# Altium project Pedal_MB.PrjPcb (part 4 of 4)

## Sheet UI.SchDoc
size A2
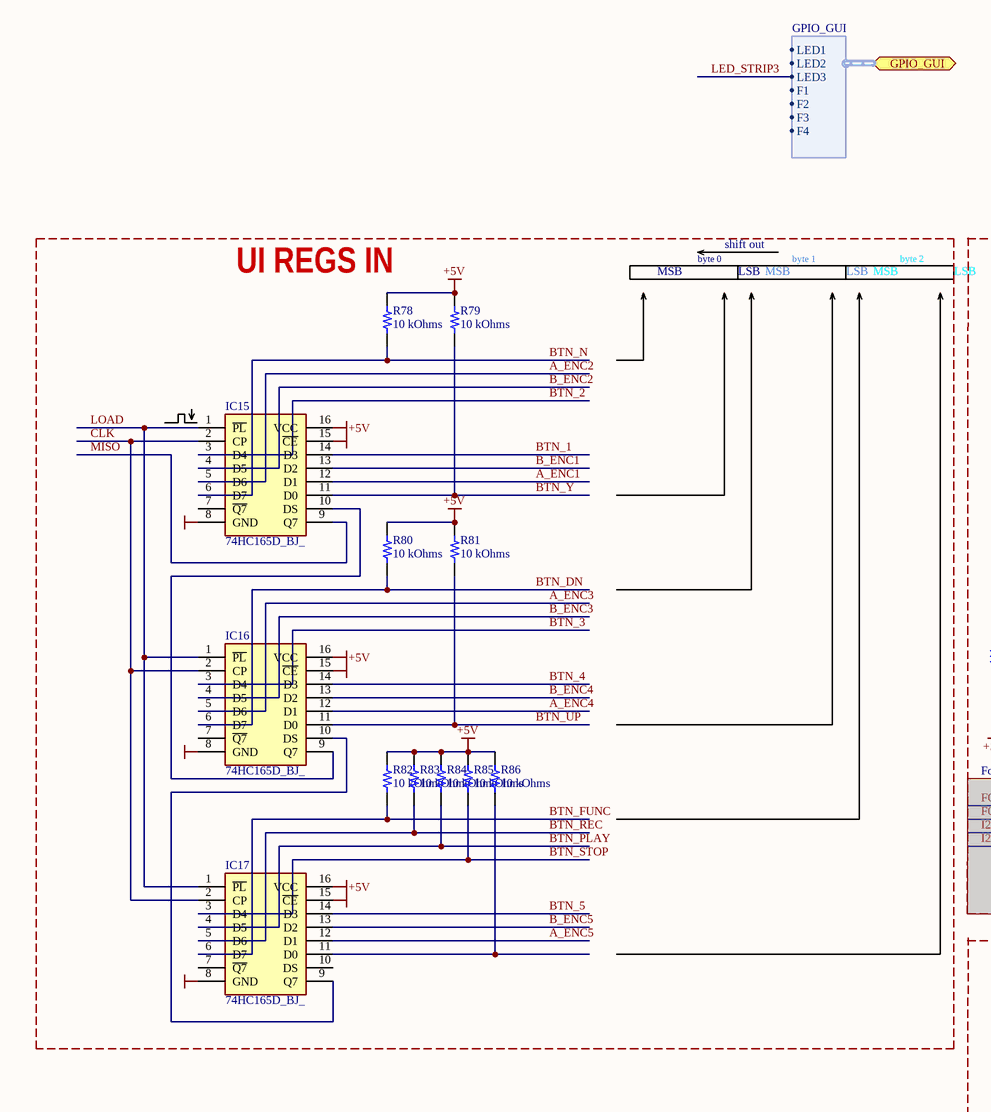
[diagram p21: UI.SchDoc, left]
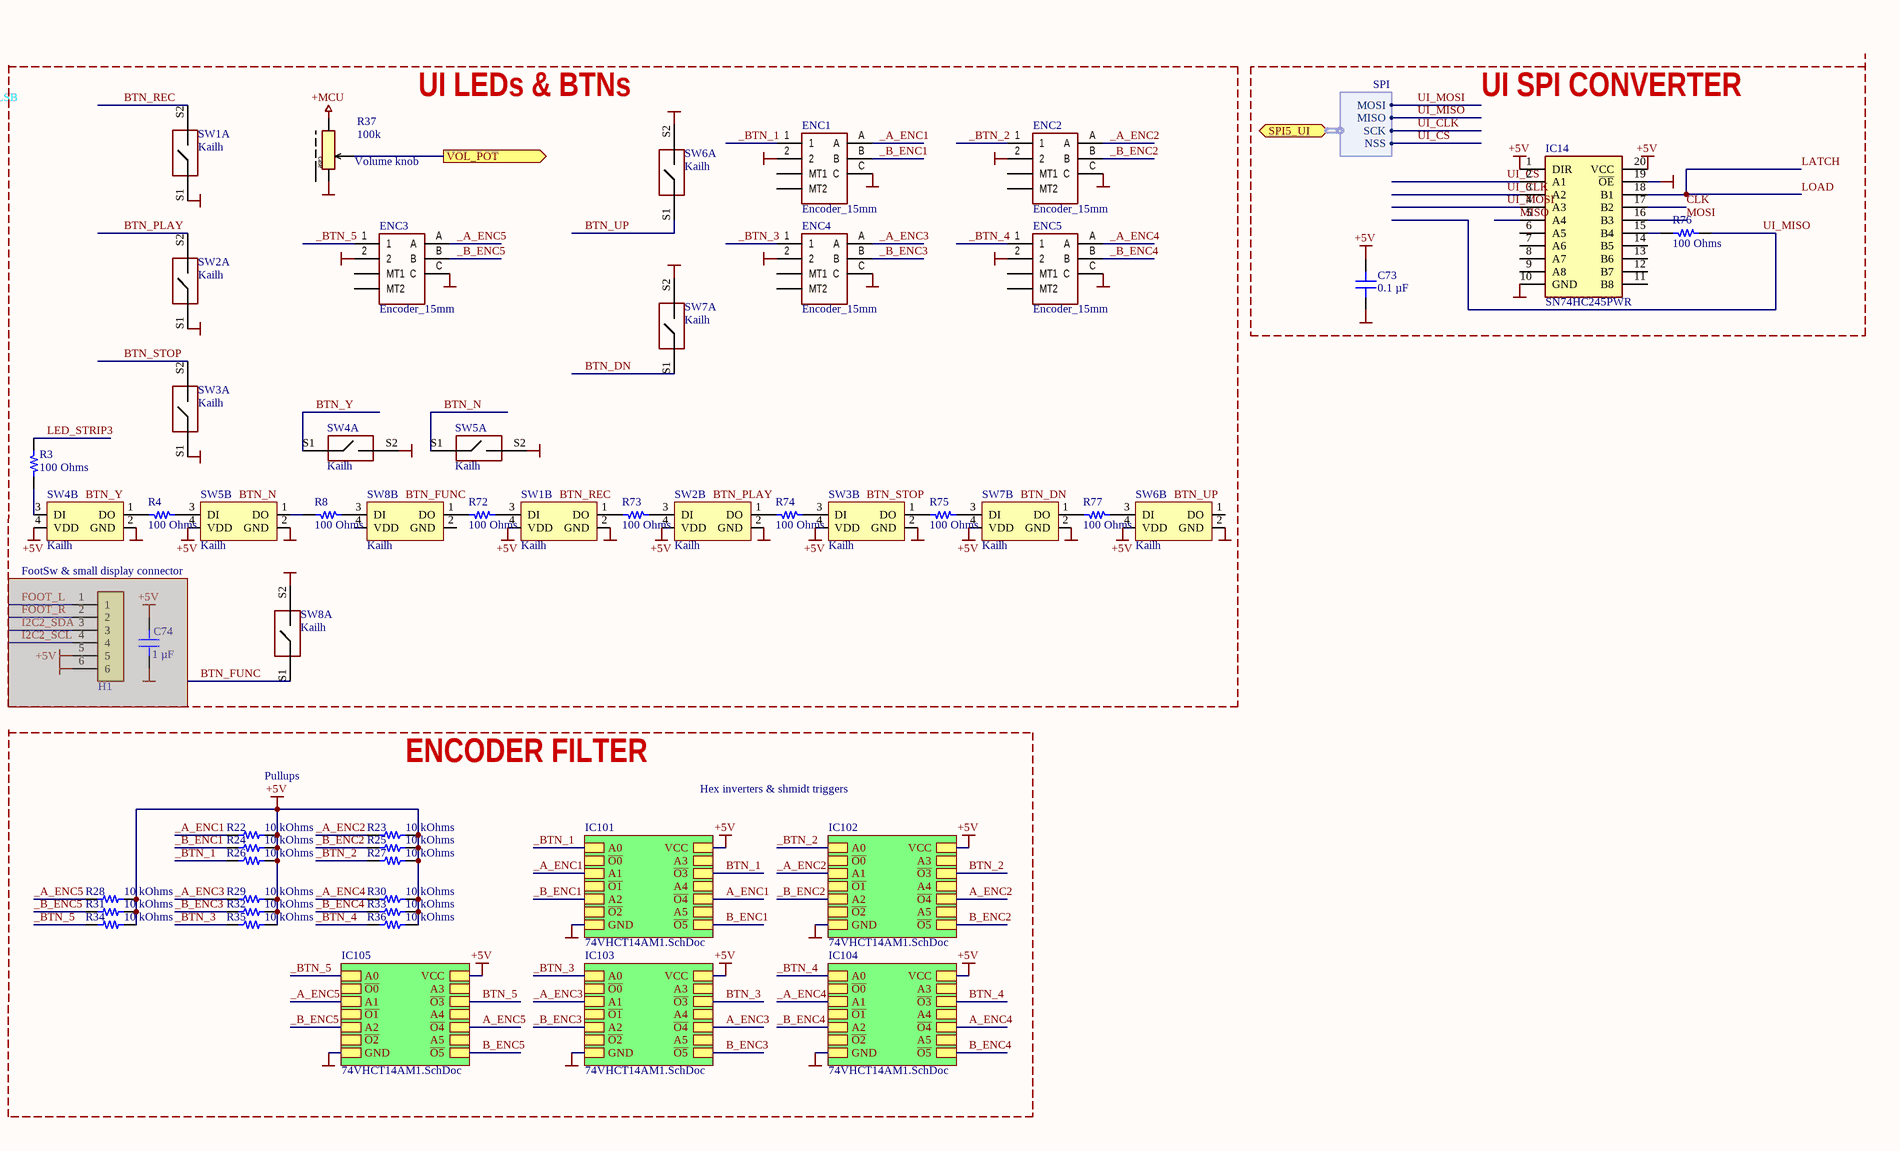
[diagram p22: UI.SchDoc, right]

### Parts
(Parts that share a designator on the sheet are numbered #1, #2 ... from top to bottom, then left to right.)
C73  0.1 µF  [CAP 0603_1608]
C74#2  1 µF  [CAP 0805_2012]  (masked out: inside a compile mask, not in the netlist)
ENC1  Encoder_15mm  [EC11_15mm]
ENC2  Encoder_15mm  [EC11_15mm]
ENC3  Encoder_15mm  [EC11_15mm]
ENC4  Encoder_15mm  [EC11_15mm]
ENC5  Encoder_15mm  [EC11_15mm]
H1#2  1.5-6A  [1.5-6A]  (value not drawn)  (masked out: inside a compile mask, not in the netlist)
IC14  SN74HC245PWR  [SOP65P640X120-20N]
IC15  74HC165D_BJ_  [SOIC127P600X175-16N]
IC16  74HC165D_BJ_  [SOIC127P600X175-16N]
IC17  74HC165D_BJ_  [SOIC127P600X175-16N]
R3#2  100 Ohms  [RES 0402_1005]
R4#2  100 Ohms  [RES 0402_1005]
R8#2  100 Ohms  [RES 0402_1005]
R22  10 kOhms  [RES 0603_1608]
R23  10 kOhms  [RES 0603_1608]
R24  10 kOhms  [RES 0603_1608]
R25  10 kOhms  [RES 0603_1608]
R26  10 kOhms  [RES 0603_1608]
R27  10 kOhms  [RES 0603_1608]
R28  10 kOhms  [RES 0603_1608]
R29  10 kOhms  [RES 0603_1608]
R30  10 kOhms  [RES 0603_1608]
R31  10 kOhms  [RES 0603_1608]
R32  10 kOhms  [RES 0603_1608]
R33  10 kOhms  [RES 0603_1608]
R34  10 kOhms  [RES 0603_1608]
R35  10 kOhms  [RES 0603_1608]
R36  10 kOhms  [RES 0603_1608]
R37  100k  [POT]
R72  100 Ohms  [RES 0402_1005]
R73  100 Ohms  [RES 0402_1005]
R74  100 Ohms  [RES 0402_1005]
R75  100 Ohms  [RES 0402_1005]
R76  100 Ohms  [RES 0402_1005]
R77  100 Ohms  [RES 0402_1005]
R78  10 kOhms  [RES 0603_1608]
R79  10 kOhms  [RES 0603_1608]
R80  10 kOhms  [RES 0603_1608]
R81  10 kOhms  [RES 0603_1608]
R82  10 kOhms  [RES 0603_1608]
R83  10 kOhms  [RES 0603_1608]
R84  10 kOhms  [RES 0603_1608]
R85  10 kOhms  [RES 0603_1608]
R86  10 kOhms  [RES 0603_1608]
SW1  Kailh  [KAILH_UNI_MX_WS2812]  (parts A,B of 2)
SW2  Kailh  [KAILH_UNI_MX_WS2812]  (parts A,B of 2)
SW3  Kailh  [KAILH_UNI_MX_WS2812]  (parts A,B of 2)
SW4  Kailh  [KAILH_UNI_MX_WS2812]  (parts A,B of 2)
SW5  Kailh  [KAILH_UNI_MX_WS2812]  (parts A,B of 2)
SW6  Kailh  [KAILH_UNI_MX_WS2812]  (parts A,B of 2)
SW7  Kailh  [KAILH_UNI_MX_WS2812]  (parts A,B of 2)
SW8  Kailh  [KAILH_UNI_MX_WS2812]  (parts A,B of 2)

### Blocks framed on the sheet
UI REGS IN: IC15-IC17 R78-R86
UI LEDs & BTNs: C74#2 ENC1-ENC5 H1#2 R3#2 R4#2 R8#2 R37 R72-R75 R77 SW1-SW8
ENCODER FILTER: R22-R36

### Sub-sheets
IC101 = 74VHCT14AM1.SchDoc: A0, ~{O0}, A1, ~{O1}, A2, ~{O2}, GND, VCC, A3, ~{O3}, A4, ~{O4}, A5, ~{O5}
IC102 = 74VHCT14AM1.SchDoc: A0, ~{O0}, A1, ~{O1}, A2, ~{O2}, GND, VCC, A3, ~{O3}, A4, ~{O4}, A5, ~{O5}
IC103 = 74VHCT14AM1.SchDoc: A0, ~{O0} (harness GPIO_GUI), A1, ~{O1}, A2, ~{O2}, GND, VCC, A3 (harness GPIO_GUI), ~{O3}, A4, ~{O4}, A5, ~{O5}
IC104 = 74VHCT14AM1.SchDoc: A0, ~{O0} (harness GPIO_GUI), A1, ~{O1}, A2, ~{O2}, GND, VCC, A3 (harness GPIO_GUI), ~{O3}, A4, ~{O4}, A5, ~{O5}
IC105 = 74VHCT14AM1.SchDoc: A0, ~{O0}, A1, ~{O1}, A2, ~{O2}, GND, VCC, A3 (harness GPIO_GUI), ~{O3}, A4 (harness GPIO_GUI), ~{O4}, A5 (harness GPIO_GUI), ~{O5}

### Ports
GPIO_GUI (bidir, harness GPIO_GUI), SPI5_UI (bidir, harness SPI), VOL_POT (out)

### Harnesses
SPI: MOSI, MISO, SCK, NSS
GPIO_GUI: LED1, LED2, F1, F2, F3, F4, LED3

### Nets
+5V: C73.2 IC14.1(DIR) IC14.20(VCC) IC15.16(VCC) IC16.16(VCC) IC17.16(VCC) R22.2 R23.2 R24.2 R25.2 R26.2 R27.2 R28.2 R29.2 R30.2 R31.2 R32.2 R33.2 R34.2 R35.2 R36.2 R78.2 R79.2 R80.2 R81.2 R82.2 R83.2 R84.2 R85.2 R86.2 SW1.4(VDD) SW2.4(VDD) SW3.4(VDD) SW4.4(VDD) SW5.4(VDD) SW6.4(VDD) SW7.4(VDD) ; sheet IC101/VCC, sheet IC102/VCC, sheet IC103/VCC, sheet IC104/VCC, sheet IC105/VCC
+MCU: R37.1
GND: C73.1 ENC1.2 ENC1.C ENC2.2 ENC2.C ENC3.2 ENC3.C ENC4.2 ENC4.C ENC5.2 ENC5.C IC14.10(GND) IC14.19(~{OE}) IC15.8(GND) IC15.15(~{CE}) IC16.8(GND) IC16.15(~{CE}) IC17.8(GND) IC17.15(~{CE}) R37.3 SW1.2(GND) SW1.S1 SW2.2(GND) SW2.S1 SW3.2(GND) SW3.S1 SW4.2(GND) SW4.S2 SW5.2(GND) SW5.S2 SW6.2(GND) SW6.S2 SW7.2(GND) SW7.S2 SW8.S2 ; sheet IC101/GND, sheet IC102/GND, sheet IC103/GND, sheet IC104/GND, sheet IC105/GND
_A_ENC1: ENC1.A R22.1 ; sheet IC101/A1
_A_ENC2: ENC2.A R23.1 ; sheet IC102/A1
_A_ENC3: ENC4.A R29.1 ; sheet IC103/A1
_A_ENC4: ENC5.A R30.1 ; sheet IC104/A1
_A_ENC5: ENC3.A R28.1 ; sheet IC105/A1
_B_ENC1: ENC1.B R24.1 ; sheet IC101/A2
_B_ENC2: ENC2.B R25.1 ; sheet IC102/A2
_B_ENC3: ENC4.B R32.1 ; sheet IC103/A2
_B_ENC4: ENC5.B R33.1 ; sheet IC104/A2
_B_ENC5: ENC3.B R31.1 ; sheet IC105/A2
_BTN_1: ENC1.1 R26.1 ; sheet IC101/A0
_BTN_2: ENC2.1 R27.1 ; sheet IC102/A0
_BTN_3: ENC4.1 R35.1 ; sheet IC103/A0
_BTN_4: ENC5.1 R36.1 ; sheet IC104/A0
_BTN_5: ENC3.1 R34.1 ; sheet IC105/A0
A_ENC1: IC15.12(D1) ; sheet IC101/~{O4}
A_ENC2: IC15.5(D6) ; sheet IC102/~{O4}
A_ENC3: IC16.5(D6) ; sheet IC103/~{O4}
A_ENC4: IC16.12(D1) ; sheet IC104/~{O4}
A_ENC5: IC17.12(D1) ; sheet IC105/~{O4}
ADC_VOL: R37.2 ; port VOL_POT
B_ENC1: IC15.13(D2) ; sheet IC101/~{O5}
B_ENC2: IC15.4(D5) ; sheet IC102/~{O5}
B_ENC3: IC16.4(D5) ; sheet IC103/~{O5}
B_ENC4: IC16.13(D2) ; sheet IC104/~{O5}
B_ENC5: IC17.13(D2) ; sheet IC105/~{O5}
BTN_1: IC15.14(D3) ; sheet IC101/~{O3}
BTN_2: IC15.3(D4) ; sheet IC102/~{O3}
BTN_3: IC16.3(D4) ; sheet IC103/~{O3}
BTN_4: IC16.14(D3) ; sheet IC104/~{O3}
BTN_5: IC17.14(D3) ; sheet IC105/~{O3}
BTN_DN: IC16.6(D7) R80.1 SW7.S1
BTN_FUNC: IC17.6(D7) R82.1 SW8.S1
BTN_N: IC15.6(D7) R78.1 SW5.S1
BTN_PLAY: IC17.4(D5) R84.1 SW2.S2
BTN_REC: IC17.5(D6) R83.1 SW1.S2
BTN_STOP: IC17.3(D4) R85.1 SW3.S2
BTN_UP: IC16.11(D0) R81.1 SW6.S1
BTN_Y: IC15.11(D0) R79.1 SW4.S1
CLK: IC14.17(B2) IC15.2(CP) IC16.2(CP) IC17.2(CP)
LATCH: IC14.18(B1) IC15.1(~{PL}) IC16.1(~{PL}) IC17.1(~{PL})  [also labelled LOAD]
LED_STRIP3: R3#2.2 ; port GPIO_GUI.LED3  [project net GPIO_GUI.LED3]
MISO: IC14.5(A4) IC15.9(Q7)
MOSI: IC14.16(B3)
UI_CLK: IC14.3(A2) ; port SPI5_UI.SCK  [project net SPI5_SCK]
UI_CS: IC14.2(A1) ; port SPI5_UI.NSS  [project net SPI5_NSS]
UI_MISO: R76.1 ; port SPI5_UI.MISO
UI_MOSI: IC14.4(A3) ; port SPI5_UI.MOSI  [project net SPI5_MOSI]
NetIC14_15: IC14.15(B4) R76.2
NetIC15_10: IC15.10(DS) IC16.9(Q7)
NetIC16_10: IC16.10(DS) IC17.9(Q7)
NetIC17_11: IC17.11(D0) R86.1
NetR3#2_1: R3#2.1 SW4.3(DI)
NetR4#2_1: R4#2.1 SW5.3(DI)
NetR4#2_2: R4#2.2 SW4.1(DO)
NetR8#2_1: R8#2.1 SW8.3(DI)
NetR8#2_2: R8#2.2 SW5.1(DO)
NetR72_1: R72.1 SW1.3(DI)
NetR72_2: R72.2 SW8.1(DO)
NetR73_1: R73.1 SW2.3(DI)
NetR73_2: R73.2 SW1.1(DO)
NetR74_1: R74.1 SW3.3(DI)
NetR74_2: R74.2 SW2.1(DO)
NetR75_1: R75.1 SW7.3(DI)
NetR75_2: R75.2 SW3.1(DO)
NetR77_1: R77.1 SW6.3(DI)
NetR77_2: R77.2 SW7.1(DO)

Not connected (* = marked no-connect by the designer): ENC1 MT1 MT2; ENC2 MT1 MT2; ENC3 MT1 MT2; ENC4 MT1 MT2; ENC5 MT1 MT2; IC14 6(A5) 7(A6) 8(A7) 9(A8) 11(B8) 12(B7) 13(B6) 14(B5); IC15 7(~{Q7}); IC16 7(~{Q7}); IC17 7(~{Q7}) 10(DS); R37 4; SW6 1(DO); SW8 2(GND) 4(VDD)

### Notes on the sheet
- byte 0
- shift out
- byte 1
- byte 2
- MSB
- LSB
- UI SPI CONVERTER
- (near R37) Volume knob
- FootSw & small display connector
- Pullups
- Hex inverters & shmidt triggers
- Labels drawn without touching a wire or pin: BTN_DN, BTN_FUNC, BTN_N, BTN_PLAY, BTN_REC, BTN_STOP, BTN_UP, BTN_Y
- (in symbol POT 9MM 100K) case

### Library data of the parts
C73 = C0603C104K5RAC7411: CAP CER 0.1UF 50V X7R 0603; manufacturer: KEMET; Tolerance: ±10%; Part Number: C0603C104K5RAC7411; Value: 0.1 µF; Applications: Bypass, Decoupling; Capacitance: 0.1 µF; componentlink1description: Datasheet; componentlink1url: https://api.kemet.com/component-edge/download/datasheet/C0603C104K5RAC7411.pdf; componentlink2description: DigiKey Link; componentlink2url: https://www.digikey.com/en/products/detail/kemet/C0603C104K5RAC7411/3317013; Device Package: 0603 (1608 Metric); lastupdated: 2/9/2024 8:10:30 PM; Lifecycle Status: Active; Minimum Order: 1; Mounting Type: Surface Mount, MLCC; Operating Temperature: -55°C ~ 125°C; Package / Case: 0603 (1608 Metric); packaging: TapeAndReel; partid: 2233; Part Status: Active; price: 0.01; series: SMD Comm X7R; Size / Dimension: 0.063" L x 0.031" W (1.60mm x 0.80mm); Supplier 1: DigiKey; Supplier Part Number 1: 399-C0603C104K5RAC7411CT-ND; Temperature Coefficient: X7R; Thickness (Max): 0.035" (0.90mm); Voltage - Rated: 50V
C74#2 = C0805C105K4RAC7800: CAP CER 1UF 16V X7R 0805; manufacturer: KEMET; Tolerance: ±10%; Part Number: C0805C105K4RAC7800; Value: 1 µF; Applications: Bypass, Decoupling; Capacitance: 1 µF; componentlink1description: Datasheet; componentlink1url: https://api.kemet.com/component-edge/download/datasheet/C0805C105K4RACTU.pdf; componentlink2description: DigiKey Link; componentlink2url: https://www.digikey.com/en/products/detail/kemet/C0805C105K4RAC7800/416047; Device Package: 0805 (2012 Metric); lastupdated: 9/19/2022 1:03:30 PM; Lifecycle Status: Active; Minimum Order: 1; Mounting Type: Surface Mount, MLCC; Operating Temperature: -55°C ~ 125°C; Package / Case: 0805 (2012 Metric); packaging: TapeAndReel; partid: 32075; Part Status: Active; price: 0.01; series: SMD Comm X7R; Size / Dimension: 0.079" L x 0.049" W (2.00mm x 1.25mm); Supplier 1: DigiKey; Supplier Part Number 1: 399-C0805C105K4RAC7800CT-ND; Temperature Coefficient: X7R; Thickness (Max): 0.039" (1.00mm); Voltage - Rated: 16V
H1#2 = 1.5-6A: Pin Header p=1.5mm, 6 pins
IC14 = SN74HC245PWR: Integrated Circuit; Manufacturer_Name: Texas Instruments; Datasheet Link: http://www.ti.com/lit/gpn/sn74hc245; Height: 1.2mm; Manufacturer_Part_Number: SN74HC245PWR; Mouser Part Number: 595-SN74HC245PWR; Mouser Price/Stock: https://www.mouser.co.uk/ProductDetail/Texas-Instruments/SN74HC245PWR?qs=JS6RUWRH9DXHcWNikQOotA%3D%3D; Arrow Part Number: SN74HC245PWR; Arrow Price/Stock: https://www.arrow.com/en/products/sn74hc245pwr/texas-instruments?region=nac
IC15-IC17 = 74HC165D_BJ_: Integrated Circuit; Manufacturer_Name: Toshiba; Manufacturer_Part_Number: 74HC165D(BJ); Datasheet Link: https://www.arrow.com/en/products/74hc165d-bj/toshiba?region=nac; Height: 1.75mm; Mouser Part Number: 757-74HC165DBJ; Mouser Price/Stock: https://www.mouser.co.uk/ProductDetail/Toshiba/74HC165DBJ?qs=lQAVKuKFhkJom8fGze1o7Q%3D%3D; Arrow Part Number: 74HC165D(BJ); Arrow Price/Stock: https://www.arrow.com/en/products/74hc165d-bj/toshiba?region=nac
R3#2 R4#2 R8#2 R72-R77 = CRCW0402100RFKEE: RES SMD 100 OHM 1% 1/16W 0402; Manufacturer: Vishay Dale; Power (Watts): 0.063W, 1/16W; Temperature Coefficient: ±100ppm/°C; Part Number: CRCW0402100RFKEE; Value: 100 Ohms; ComponentLink1Description: Datasheet; ComponentLink1URL: http://www.vishay.com/docs/20035/dcrcwe3.pdf; ComponentLink2Description: DigiKey Link; ComponentLink2URL: https://www.digikey.com/en/products/detail/vishay-dale/CRCW0402100RFKEE/5069886; Composition: Thick Film; Device Package: 0402 (1005 Metric); Height - Seated (Max): 0.016" (0.40mm); LastUpdated: 2/9/2024 8:30:05 PM; Lifecycle Status: Active; Minimum Order: 1; Number of Terminations: 2; Operating Temperature: -55°C ~ 155°C; Package / Case: 0402 (1005 Metric); Packaging: CutTape; PartId: 6830; Part Status: Active; Price: 0.01; Resistance: 100 Ohms; Series: CRCW; Size / Dimension: 0.039" L x 0.020" W (1.00mm x 0.50mm); Supplier 1: DigiKey; Supplier Part Number 1: 541-2953-1-ND; Supplier Device Package: 0402; Tolerance: ±1%; Features: Automotive AEC-Q200; Ratings: AEC-Q200
R22-R36 = ERJ-3EKF1002V: RES SMD 10K OHM 1% 1/10W 0603; Part Number: ERJ-3EKF1002V; Value: 10 kOhms
R37 = POT 9MM 100K
R78-R86 = ERJ-3EKF1002V: RES SMD 10K OHM 1% 1/10W 0603; Manufacturer: Panasonic Electronic Components; Power (Watts): 0.1W, 1/10W; Temperature Coefficient: ±100ppm/°C; Part Number: ERJ-3EKF1002V; Value: 10 kOhms; ComponentLink1Description: Datasheet; ComponentLink1URL: https://industrial.panasonic.com/cdbs/www-data/pdf/RDA0000/AOA0000C304.pdf; ComponentLink2Description: DigiKey Link; ComponentLink2URL: https://www.digikey.com/en/products/detail/panasonic-electronic-components/ERJ-3EKF1002V/196066; Composition: Thick Film; Device Package: 0603 (1608 Metric); Height - Seated (Max): 0.022" (0.55mm); LastUpdated: 2/9/2024 8:41:59 PM; Lifecycle Status: Active; Minimum Order: 1; Number of Terminations: 2; Operating Temperature: -55°C ~ 155°C; Package / Case: 0603 (1608 Metric); Packaging: TapeAndReel; PartId: 25695; Part Status: Active; Price: 0.01; Resistance: 10 kOhms; Series: ERJ-3EK; Size / Dimension: 0.063" L x 0.031" W (1.60mm x 0.80mm); Supplier 1: DigiKey; Supplier Part Number 1: P10.0KHCT-ND; Supplier Device Package: 0603; Tolerance: ±1%; Features: Automotive AEC-Q200; Ratings: AEC-Q200
SW1-SW8 = Kailh_hotswap_WS2812: Kailh keyboard switch, hotswap rgb, dual-side hotswap options + low prifile variant

## Sheet 74VHCT14AM1.SchDoc
size A4; SheetNumber: 4; SheetTotal: 10
Used 5 times, as channels U_UI/IC101, U_UI/IC102, U_UI/IC103, U_UI/IC104, U_UI/IC105. Parts and nets are listed once, with the designators drawn on the sheet.
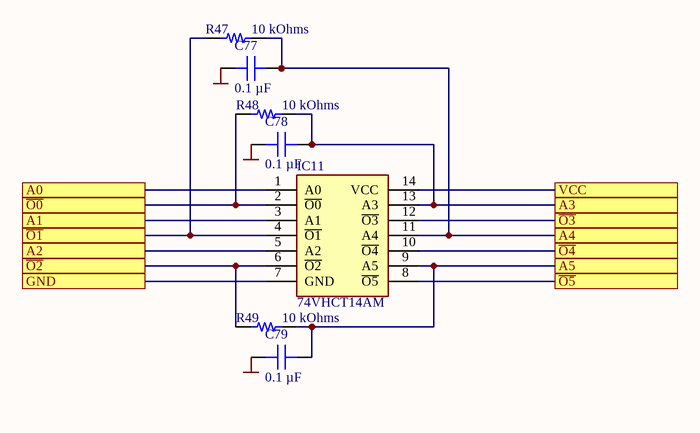
[diagram p23: 74VHCT14AM1.SchDoc]

### Parts
C77  0.1 µF  [CAP 0603_1608]
C78  0.1 µF  [CAP 0603_1608]
C79  0.1 µF  [CAP 0603_1608]
IC11  74VHCT14AM  [SOIC127P600X175-14N]
R47  10 kOhms  [RES 0603_1608]
R48  10 kOhms  [RES 0603_1608]
R49  10 kOhms  [RES 0603_1608]

### Ports
A0, A1, A2, A3, A4, A5, GND, VCC, ~{O0}, ~{O1}, ~{O2}, ~{O3}, ~{O4}, ~{O5}

### Nets
GND: C77.2 C78.2 C79.2
A0: IC11.1(A0) ; port A0
A1: IC11.3(A1) ; port A1
A2: IC11.5(A2) ; port A2
A3: C78.1 IC11.13(A3) R48.2 ; port A3
A4: C77.1 IC11.11(A4) R47.2 ; port A4
A5: C79.1 IC11.9(A5) R49.2 ; port A5
GND: IC11.7(GND) ; port GND  [a separate net that carries the same name]
~{O0}: IC11.2(~{O0}) R48.1 ; port ~{O0}
~{O1}: IC11.4(~{O1}) R47.1 ; port ~{O1}
~{O2}: IC11.6(~{O2}) R49.1 ; port ~{O2}
~{O3}: IC11.12(~{O3}) ; port ~{O3}
~{O4}: IC11.10(~{O4}) ; port ~{O4}
~{O5}: IC11.8(~{O5}) ; port ~{O5}
VCC: IC11.14(VCC) ; port VCC

### Channels
U_UI/IC101: designators end in _IC101; ports A0=_BTN_1 A1=_A_ENC1 A2=_B_ENC1 A3=A3_IC101 A4=A4_IC101 A5=A5_IC101 GND=GND VCC=+5V ~{O0}=~{O0}_IC101 ~{O1}=~{O1}_IC101 ~{O2}=~{O2}_IC101 ~{O3}=BTN_1 ~{O4}=A_ENC1 ~{O5}=B_ENC1
U_UI/IC102: designators end in _IC102; ports A0=_BTN_2 A1=_A_ENC2 A2=_B_ENC2 A3=A3_IC102 A4=A4_IC102 A5=A5_IC102 GND=GND VCC=+5V ~{O0}=~{O0}_IC102 ~{O1}=~{O1}_IC102 ~{O2}=~{O2}_IC102 ~{O3}=BTN_2 ~{O4}=A_ENC2 ~{O5}=B_ENC2
U_UI/IC103: designators end in _IC103; ports A0=_BTN_3 A1=_A_ENC3 A2=_B_ENC3 A3=A3_IC103 A4=A4_IC103 A5=A5_IC103 GND=GND VCC=+5V ~{O0}=~{O0}_IC103 ~{O1}=~{O1}_IC103 ~{O2}=~{O2}_IC103 ~{O3}=BTN_3 ~{O4}=A_ENC3 ~{O5}=B_ENC3
U_UI/IC104: designators end in _IC104; ports A0=_BTN_4 A1=_A_ENC4 A2=_B_ENC4 A3=A3_IC104 A4=A4_IC104 A5=A5_IC104 GND=GND VCC=+5V ~{O0}=~{O0}_IC104 ~{O1}=~{O1}_IC104 ~{O2}=~{O2}_IC104 ~{O3}=BTN_4 ~{O4}=A_ENC4 ~{O5}=B_ENC4
U_UI/IC105: designators end in _IC105; ports A0=_BTN_5 A1=_A_ENC5 A2=_B_ENC5 A3=A3_IC105 A4=A4_IC105 A5=A5_IC105 GND=GND VCC=+5V ~{O0}=~{O0}_IC105 ~{O1}=~{O1}_IC105 ~{O2}=~{O2}_IC105 ~{O3}=BTN_5 ~{O4}=A_ENC5 ~{O5}=B_ENC5

### Library data of the parts
C77-C79 = C0603C104K5RAC7411: as C73 on sheet UI; Part Number: C0603C104K5RAC7411; Value: 0.1 µF; Applications: Bypass, Decoupling; Capacitance: 0.1 µF; componentlink1description: Datasheet; componentlink1url: https://api.kemet.com/component-edge/download/datasheet/C0603C104K5RAC7411.pdf; componentlink2description: DigiKey Link; componentlink2url: https://www.digikey.com/en/products/detail/kemet/C0603C104K5RAC7411/3317013; Device Package: 0603 (1608 Metric); lastupdated: 2/9/2024 8:10:30 PM; Lifecycle Status: Active; Minimum Order: 1; Mounting Type: Surface Mount, MLCC; Operating Temperature: -55°C ~ 125°C; Package / Case: 0603 (1608 Metric); packaging: TapeAndReel; partid: 2233; Part Status: Active; price: 0.01; series: SMD Comm X7R; Size / Dimension: 0.063" L x 0.031" W (1.60mm x 0.80mm); Supplier 1: DigiKey; Supplier Part Number 1: 399-C0603C104K5RAC7411CT-ND; Temperature Coefficient: X7R; Thickness (Max): 0.035" (0.90mm); Voltage - Rated: 50V
IC11 = 74VHCT14AM: Integrated Circuit; Manufacturer_Name: onsemi; Datasheet Link: https://docs.rs-online.com/5e2e/0900766b812cf5b5.pdf; Height: 1.75mm; Manufacturer_Part_Number: 74VHCT14AM; Mouser Part Number: 512-74VHCT14AM; Mouser Price/Stock: https://www.mouser.com/Search/Refine.aspx?Keyword=512-74VHCT14AM; Arrow Part Number: 74VHCT14AM; Arrow Price/Stock: https://www.arrow.com/en/products/74vhct14am/on-semiconductor
R47-R49 = ERJ-3EKF1002V: as R78 on sheet UI; Part Number: ERJ-3EKF1002V; Value: 10 kOhms; ComponentLink1Description: Datasheet; ComponentLink1URL: https://industrial.panasonic.com/cdbs/www-data/pdf/RDA0000/AOA0000C304.pdf; ComponentLink2Description: DigiKey Link; ComponentLink2URL: https://www.digikey.com/en/products/detail/panasonic-electronic-components/ERJ-3EKF1002V/196066; Composition: Thick Film; Device Package: 0603 (1608 Metric); Height - Seated (Max): 0.022" (0.55mm); LastUpdated: 2/9/2024 8:41:59 PM; Lifecycle Status: Active; Minimum Order: 1; Number of Terminations: 2; Operating Temperature: -55°C ~ 155°C; Package / Case: 0603 (1608 Metric); Packaging: TapeAndReel; PartId: 25695; Part Status: Active; Price: 0.01; Resistance: 10 kOhms; Series: ERJ-3EK; Size / Dimension: 0.063" L x 0.031" W (1.60mm x 0.80mm); Supplier 1: DigiKey; Supplier Part Number 1: P10.0KHCT-ND; Supplier Device Package: 0603; Tolerance: ±1%; Features: Automotive AEC-Q200; Ratings: AEC-Q200

## Sheet LOOP_LEDS.SchDoc
size A4
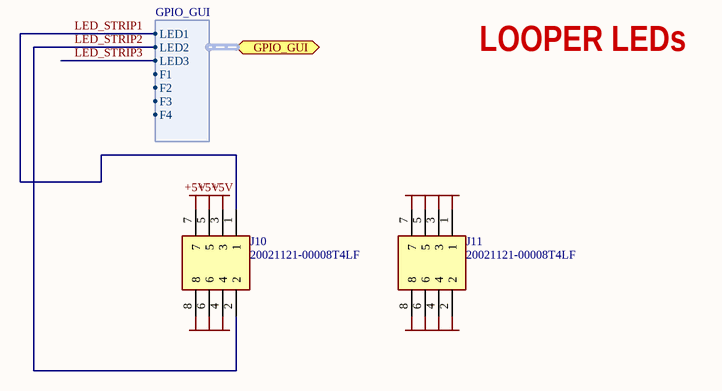
[diagram p24: LOOP_LEDS.SchDoc]

### Parts
(Parts that share a designator on the sheet are numbered #1, #2 ... from top to bottom, then left to right.)
J10#2  20021121-00008T4LF  [2002112100008T4LF]
J11#2  20021121-00008T4LF  [2002112100008T4LF]

### Ports
GPIO_GUI (bidir, harness GPIO_GUI)

### Harnesses
GPIO_GUI: LED1, LED2, F1, F2, F3, F4, LED3

### Nets
+5V: J10#2.3 J10#2.5 J10#2.7
GND: J10#2.4 J10#2.6 J10#2.8 J11#2.1 J11#2.2 J11#2.3 J11#2.4 J11#2.5 J11#2.6 J11#2.7 J11#2.8
LED_STRIP1: J10#2.1 ; port GPIO_GUI.LED1  [project net GPIO_GUI.LED1]
LED_STRIP2: J10#2.2 ; port GPIO_GUI.LED2  [project net GPIO_GUI.LED2]

### Notes on the sheet
- LOOPER LEDs

### Library data of the parts
J10#2 J11#2 = 20021121-00008T4LF: Connector; Manufacturer_Name: Amphenol Communications Solutions; Datasheet Link: https://cdn.amphenol-cs.com/media/wysiwyg/files/drawing/20021121.pdf; Height: 4.55mm; Manufacturer_Part_Number: 20021121-00008T4LF
  J10#2: System: Connector

## Nets that join several sheets
+5V: 3d_dsn_approx (TP13.1), MCU_GUI (C76.2 IC22.3), MCU_AUDIO (C72.2 IC9.3), LCD_big (C75.2 IC10.3), FOOT_CN (C85.2 J3#2.10 J3#2.12), Codec_CN (J2#2.2 J2#2.4), Power (5 pins), UI (37 pins), U_UI/IC101 (IC11_IC101.14), U_UI/IC102 (IC11_IC102.14), U_UI/IC103 (IC11_IC103.14), U_UI/IC104 (IC11_IC104.14), U_UI/IC105 (IC11_IC105.14), LOOP_LEDS (J10#2.3 J10#2.5 J10#2.7)
+MCU: 3d_dsn_approx (5 pins), MCU_GUI (63 pins), MCU_AUDIO (63 pins), MISO_LSH (C61.1 IC4.5), Codec_CN (U5.5 U7.5), MIDI (8 pins), USB_DBG (C88.2 J20.A4B9 J20.B4A9), UI (R37.1)
GND: 3d_dsn_approx (6 pins), MCU_GUI (69 pins), MCU_AUDIO (68 pins), MISO_LSH (C61.2 IC4.1 IC4.3), LCD_big (11 pins), FOOT_CN (C85.1 J3#2.1 J3#2.9 J3#2.11), Codec_CN (12 pins), MIDI (10 pins), JACKS (PJ2.2 PJ2.22), USB_DBG (C88.1 J20.A1B12 J20.B1A12), Power (25 pins), UI (35 pins), U_UI/IC101 (C77_IC101.2 C78_IC101.2 C79_IC101.2 IC11_IC101.7), U_UI/IC102 (C77_IC102.2 C78_IC102.2 C79_IC102.2 IC11_IC102.7), U_UI/IC103 (C77_IC103.2 C78_IC103.2 C79_IC103.2 IC11_IC103.7), U_UI/IC104 (C77_IC104.2 C78_IC104.2 C79_IC104.2 IC11_IC104.7), U_UI/IC105 (C77_IC105.2 C78_IC105.2 C79_IC105.2 IC11_IC105.7), LOOP_LEDS (11 pins)
V_USB: 3d_dsn_approx (H2#2.1 H2#2.2 H2#2.3 TP12.1), Power (7 pins)
_A_ENC1: UI (ENC1.A R22.1), U_UI/IC101 (IC11_IC101.3)
_A_ENC2: UI (ENC2.A R23.1), U_UI/IC102 (IC11_IC102.3)
_A_ENC3: UI (ENC4.A R29.1), U_UI/IC103 (IC11_IC103.3)
_A_ENC4: UI (ENC5.A R30.1), U_UI/IC104 (IC11_IC104.3)
_A_ENC5: UI (ENC3.A R28.1), U_UI/IC105 (IC11_IC105.3)
_B_ENC1: UI (ENC1.B R24.1), U_UI/IC101 (IC11_IC101.5)
_B_ENC2: UI (ENC2.B R25.1), U_UI/IC102 (IC11_IC102.5)
_B_ENC3: UI (ENC4.B R32.1), U_UI/IC103 (IC11_IC103.5)
_B_ENC4: UI (ENC5.B R33.1), U_UI/IC104 (IC11_IC104.5)
_B_ENC5: UI (ENC3.B R31.1), U_UI/IC105 (IC11_IC105.5)
_BTN_1: UI (ENC1.1 R26.1), U_UI/IC101 (IC11_IC101.1)
_BTN_2: UI (ENC2.1 R27.1), U_UI/IC102 (IC11_IC102.1)
_BTN_3: UI (ENC4.1 R35.1), U_UI/IC103 (IC11_IC103.1)
_BTN_4: UI (ENC5.1 R36.1), U_UI/IC104 (IC11_IC104.1)
_BTN_5: UI (ENC3.1 R34.1), U_UI/IC105 (IC11_IC105.1)
A_ENC1: UI (IC15.12), U_UI/IC101 (IC11_IC101.10)
A_ENC2: UI (IC15.5), U_UI/IC102 (IC11_IC102.10)
A_ENC3: UI (IC16.5), U_UI/IC103 (IC11_IC103.10)
A_ENC4: UI (IC16.12), U_UI/IC104 (IC11_IC104.10)
A_ENC5: UI (IC17.12), U_UI/IC105 (IC11_IC105.10)
ADC_ON: MCU_GUI (IC1#1.137 TP10.1), Power (R39.1 R51.2)
ADC_VBAT: MCU_GUI (IC1#1.37), Power (R50.2)
ADC_VOL: MCU_GUI (IC1#1.42), UI (R37.2)
ADC_VUSB: MCU_GUI (IC1#1.27), Power (R11.1 R19.2)
AUDIO_BOOT: MCU_GUI (IC1#1.3), MCU_AUDIO (R106#1.1)
AUDIO_NRST: MCU_AUDIO (C8.2 IC2#1.25 Q2.3 R6.2), USB_DBG (J20.B5)
AUDIO_RST: MCU_GUI (IC1#1.2), MCU_AUDIO (R107.1)
AUDIO_SWD.CLK: MCU_AUDIO (IC2#1.109), JACKS (J15.1), USB_DBG (J20.B8)
AUDIO_SWD.IO: MCU_AUDIO (IC2#1.105), JACKS (J16.1), USB_DBG (J20.B7)
AUDIO_SWD.SWO: MCU_AUDIO (IC2#1.133), USB_DBG (J20.B6)
B_ENC1: UI (IC15.13), U_UI/IC101 (IC11_IC101.8)
B_ENC2: UI (IC15.4), U_UI/IC102 (IC11_IC102.8)
B_ENC3: UI (IC16.4), U_UI/IC103 (IC11_IC103.8)
B_ENC4: UI (IC16.13), U_UI/IC104 (IC11_IC104.8)
B_ENC5: UI (IC17.13), U_UI/IC105 (IC11_IC105.8)
BTN_1: UI (IC15.14), U_UI/IC101 (IC11_IC101.12)
BTN_2: UI (IC15.3), U_UI/IC102 (IC11_IC102.12)
BTN_3: UI (IC16.3), U_UI/IC103 (IC11_IC103.12)
BTN_4: UI (IC16.14), U_UI/IC104 (IC11_IC104.12)
BTN_5: UI (IC17.14), U_UI/IC105 (IC11_IC105.12)
CHARGE_STATUS: MCU_GUI (IC1#1.134), Power (IC23.1 R126.1 R132.2)
CHR1: MCU_GUI (IC1#1.129), Power (R133.1)
CHR2: MCU_GUI (IC1#1.128), Power (R134.1)
CODEC_GPIO1: MCU_AUDIO (IC2#1.7), Codec_CN (U5.1)
CODEC_GPIO2: MCU_AUDIO (IC2#1.8), Codec_CN (U7.1)
D0: MCU_GUI (IC1#1.85 U1.2 U2.2), LCD_big (R56.2)
D1: MCU_GUI (IC1#1.86 U1.4 U2.4), LCD_big (R57.2)
D2: MCU_GUI (IC1#1.114 U1.5 U2.5), LCD_big (R58.2)
D3: MCU_GUI (IC1#1.115 U1.7 U2.7), LCD_big (R59.2)
D4: MCU_GUI (IC1#1.58 U1.8 U2.8), LCD_big (R60.2)
D5: MCU_GUI (IC1#1.59 U1.10 U2.10), LCD_big (R61.2)
D6: MCU_GUI (IC1#1.60 U1.11 U2.11), LCD_big (R62.2)
D7: MCU_GUI (IC1#1.63 U1.13 U2.13), LCD_big (R63.2)
D8: MCU_GUI (IC1#1.64 U1.42 U2.42), LCD_big (R64.2)
D9: MCU_GUI (IC1#1.65 U1.44 U2.44), LCD_big (R65.2)
D10: MCU_GUI (IC1#1.66 U1.45 U2.45), LCD_big (R66.2)
D11: MCU_GUI (IC1#1.67 U1.47 U2.47), LCD_big (R67.2)
D12: MCU_GUI (IC1#1.68 U1.48 U2.48), LCD_big (R68.2)
D13: MCU_GUI (IC1#1.77 U1.50 U2.50), LCD_big (R69.2)
D14: MCU_GUI (IC1#1.78 U1.51 U2.51), LCD_big (R70.2)
D15: MCU_GUI (IC1#1.79 U1.53 U2.53), LCD_big (R71.2)
FMC_A22_RS: MCU_GUI (IC1#1.5), LCD_big (R41.2)
FMC_NE1_CS: MCU_GUI (IC1#1.97), LCD_big (R40.2)
FMC_NOE_RD: MCU_GUI (IC1#1.118), LCD_big (R55.2)
FMC_NWE_WE: MCU_GUI (IC1#1.119), LCD_big (R54.2)
FOOT1: MCU_GUI (IC1#1.92), FOOT_CN (J3#2.4)
FOOT2: MCU_GUI (IC1#1.88), FOOT_CN (J3#2.2)
FOOT3: MCU_GUI (IC1#1.87), FOOT_CN (J3#2.3)
GPIO_GUI.LED1: MCU_GUI (IC1#1.43), LOOP_LEDS (J10#2.1)
GPIO_GUI.LED2: MCU_GUI (IC1#1.46), LOOP_LEDS (J10#2.2)
GPIO_GUI.LED3: MCU_GUI (IC1#1.47), UI (R3#2.2)
GUI_NRST: MCU_GUI (C7#2.2 IC1#1.25 R5#2.2), USB_DBG (J20.A5)
GUI_SWD.CLK: MCU_GUI (IC1#1.109), JACKS (J17.1), USB_DBG (J20.A8)
GUI_SWD.IO: MCU_GUI (IC1#1.105), JACKS (J18.1), USB_DBG (J20.A7)
GUI_SWD.SWO: MCU_GUI (IC1#1.133), USB_DBG (J20.A6)
I2C1_SCL: MCU_AUDIO (IC2#1.139 IC8.6 R15.1), Codec_CN (U5.2 U7.2)
I2C1_SDA: MCU_AUDIO (IC2#1.140 IC8.5 R16.1), Codec_CN (R150.1)
I2C2_SCL: MCU_GUI (IC1#1.69), FOOT_CN (J7#2.2)
I2C2_SDA: MCU_GUI (IC1#1.70), FOOT_CN (J9#2.2)
I2S3_CK: MCU_AUDIO (IC2#1.111), Codec_CN (R155.1)
I2S3_MCK: MCU_AUDIO (IC2#1.97), Codec_CN (R156.1)
I2S3_SDI: MCU_AUDIO (IC2#1.112), Codec_CN (R152.1)
I2S3_SDO: MCU_AUDIO (IC2#1.113), Codec_CN (R153.1)
I2S3_WS: MCU_AUDIO (IC2#1.110), Codec_CN (R154.1)
I2S_CKIN: MCU_AUDIO (IC2#1.99), Codec_CN (R148.1)
LCD_RESET: MCU_GUI (IC1#1.96), LCD_big (H3.41 R46.1)
LCD_TE: MCU_GUI (IC1#1.48), LCD_big (R137.2)
LED_REAR: 3d_dsn_approx (R138.2), MCU_GUI (IC1#1.110)
SAI1_MCLK: MCU_AUDIO (IC2#1.1), Codec_CN (R145.1)
SAI1_SCK: MCU_AUDIO (IC2#1.4), Codec_CN (R144.1)
SAI1_SD_A: MCU_AUDIO (IC2#1.5), Codec_CN (R141.1)
SAI2_SD_A: MCU_AUDIO (IC2#1.80), Codec_CN (R146.1)
SAI2_SD_B: MCU_AUDIO (IC2#1.34), Codec_CN (R147.1)
SD_CK: 3d_dsn_approx (H4.5), MCU_GUI (IC1#1.113)
SD_CMD: 3d_dsn_approx (H4.6), MCU_GUI (IC1#1.116)
SD_D0: 3d_dsn_approx (H4.1), MCU_GUI (IC1#1.98)
SD_D1: 3d_dsn_approx (H4.2), MCU_GUI (IC1#1.99)
SD_D2: 3d_dsn_approx (H4.3), MCU_GUI (IC1#1.111)
SD_D3: 3d_dsn_approx (H4.4), MCU_GUI (IC1#1.112)
SD_DETECT: 3d_dsn_approx (H1#1.1), MCU_GUI (IC1#1.102)
SPI1_MISO: MCU_GUI (IC1#1.124), MCU_AUDIO (IC2#1.124)
SPI1_MOSI: MCU_GUI (IC1#1.123), MCU_AUDIO (IC2#1.123)
SPI1_NSS: MCU_GUI (IC1#1.125), MCU_AUDIO (IC2#1.125)
SPI1_SCK: MCU_GUI (IC1#1.126), MCU_AUDIO (IC2#1.126)
SPI2_ext.MISO: MCU_GUI (IC1#1.75), FOOT_CN (J14.2)
SPI2_ext.MOSI: MCU_GUI (IC1#1.76), FOOT_CN (J9#2.4)
SPI2_ext.NSS: MCU_GUI (IC1#1.73), FOOT_CN (J14.4)
SPI2_ext.SCK: MCU_GUI (IC1#1.74), FOOT_CN (J7#2.4)
SPI2_MISO: MCU_AUDIO (IC2#1.75), Codec_CN (R158.1)
SPI2_MOSI: MCU_AUDIO (IC2#1.76), Codec_CN (R157.1)
SPI2_NSS: MCU_AUDIO (IC2#1.73), Codec_CN (R160.1)
SPI2_SCK: MCU_AUDIO (IC2#1.74), Codec_CN (R159.1)
SPI5_MISO: MCU_GUI (IC1#1.20), MISO_LSH (IC4.4)
SPI5_MOSI: MCU_GUI (IC1#1.21), UI (IC14.4)
SPI5_NSS: MCU_GUI (IC1#1.18), UI (IC14.2)
SPI5_SCK: MCU_GUI (IC1#1.19), UI (IC14.3)
UART1_RX: MCU_GUI (IC1#1.122), MCU_AUDIO (IC2#1.102 TP7.1)
UART1_TX: MCU_GUI (IC1#1.36), MCU_AUDIO (IC2#1.101 TP8.1)
UART4_RX: MCU_GUI (IC1#1.35 TP2.1), MIDI (IC18.2 R2.4 U6.4)
UART4_TX: MCU_GUI (IC1#1.34 TP1.1), MIDI (IC19.2)
UI_MISO: MISO_LSH (IC4.2), UI (R76.1)
USB_FS_DM: 3d_dsn_approx (R136.1), MCU_GUI (IC1#1.103)
USB_FS_DP: 3d_dsn_approx (R135.1), MCU_GUI (IC1#1.104)
USB_FS_SOF: 3d_dsn_approx (TP9.1), MCU_GUI (IC1#1.100)
USB_FS_VBUS: 3d_dsn_approx (H2#2.4), MCU_GUI (IC1#1.101 TP11.1)